# EAGLE design untitled (EAGLE 6.5.0)
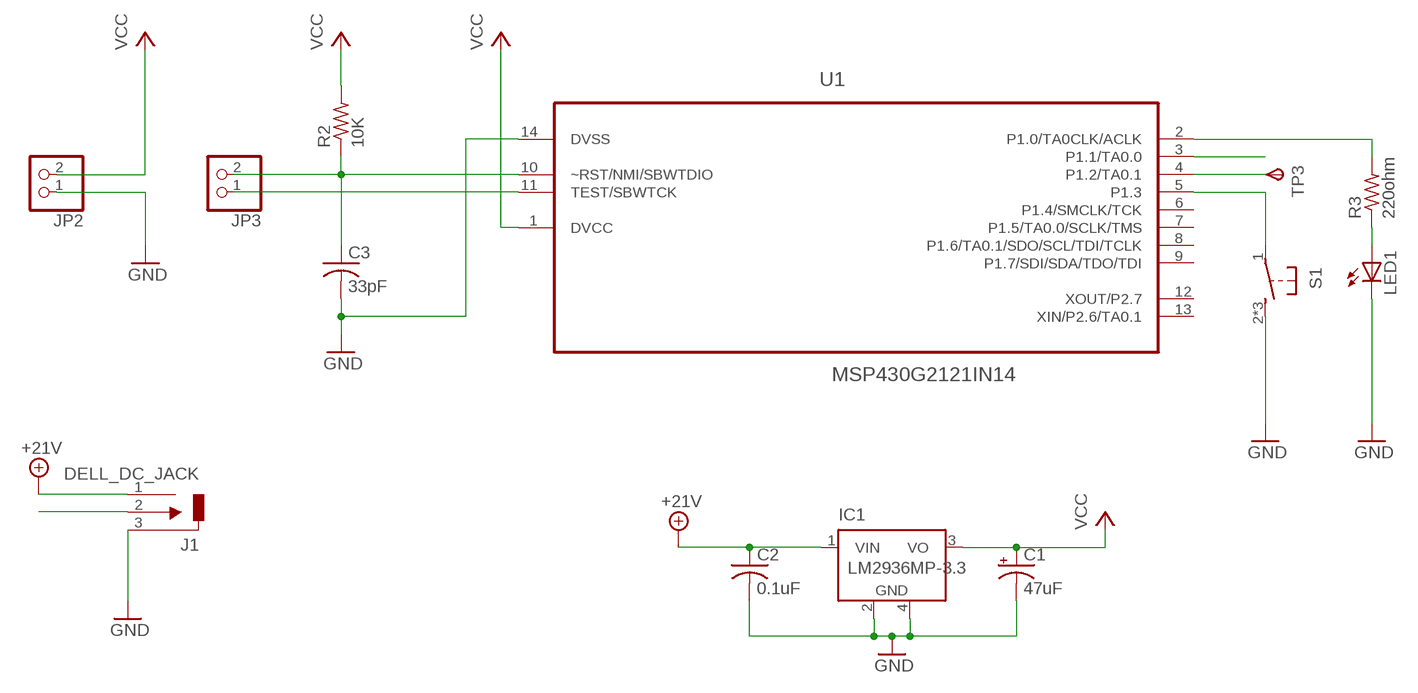
[diagram p0: schematic, sheet 1]

## Parts
C1  47uF  CPOL-USE2.5-5  [E2,5-5]
C2  0.1uF  C-US025-025X050  [C025-025X050]
C3  33pF  C-US025-025X050  [C025-025X050]
IC1  LM2936MP-3.3  [SOT223]
J1  DELL_DC_JACK  [DELL_DC_JACK]
JP2  PINHD-1X2  [1X02]
JP3  PINHD-1X2  [1X02]
LED1  LED3MM  [LED3MM]
R2  10K  R-US_0207/12  [0207/12]
R3  220ohm  R-US_0207/12  [0207/12]
S1  31-XX  [B3F-31XX]
TP3  TPSPAD1-13  [P1-13]
U1  MSP430G2121IN14  [DIP254P762X508-14]

## Nets
+21V: C2.1 IC1.1(VIN) J1.1(VIN)
GND: C1.- C2.2 C3.2 IC1.2(GND) IC1.4(GND) J1.3(GND) JP2.1 LED1.K(C) S1.2(S) S1.3(S) S1.4(S) U1.14(DVSS)
N$1: C3.1 JP3.2 R2.1 U1.10(~RST/NMI/SBWTDIO)
N$2: JP3.1 U1.11(TEST/SBWTCK)
N$3: R3.2 U1.2(P1.0/TA0CLK/ACLK)
N$4: LED1.A R3.1
N$5: TP3.TP(PP) U1.4(P1.2/TA0.1)
N$7: S1.1(P) U1.5(P1.3)
SIG: J1.2(SIG) U1.3(P1.1/TA0.0)
VCC: C1.+ IC1.3(VO) JP2.2 R2.2 U1.1(DVCC)
Unconnected: U1.6(P1.4/SMCLK/TCK) U1.7(P1.5/TA0.0/SCLK/TMS) U1.8(P1.6/TA0.1/SDO/SCL/TDI/TCLK) U1.9(P1.7/SDI/SDA/TDO/TDI) U1.12(XOUT/P2.7) U1.13(XIN/P2.6/TA0.1)

## Library data of the parts
C1 = rcl:CPOL-US: POLARIZED CAPACITOR, American symbol
C2 C3 = rcl:C-US: CAPACITOR, American symbol
IC1 = national-semiconductor:LM2936MP?*: Ultra-Low Quiescent Current LDO Voltage Regulator Source: Data sheet <http://www.national.com/ds/LM/LM2936.pdf>; MF: NATIONAL SEMICONDUCTOR; MPN: LM2936MP-3.3/NOPB; OC_FARNELL: 1469062; OC_NEWARK: 41K4523
J1 = custom:DELL_DC_JACK: DELL LAPTOP DC POWER JACK; OC_FARNELL: unknown; OC_NEWARK: unknown
JP2 JP3 = pinhead:PINHD-1X2: PIN HEADER
LED1 = led:LED: LED OSRAM: - CHIPLED LG R971, LG N971, LY N971, LG Q971, LY Q971, LO R971, LY R971 LH N974, LH R974 LS Q976, LO Q976, LY Q976 LO Q996 - Hyper CHIPLED LW Q18S LB Q993, LB Q99A, LB R99A - SideLED LS A670, LO A670, LY A670, LG A670, LP A670 LB A673, LV A673, LT A673, LW A673 LH A674 LY A675 LS A676, LA A676, LO A676, LY A676, LW A676 LS A679, LY A679, LG A679 - Hyper Micro SIDELED® LS Y876, LA Y876, LO Y876, LY Y876 LT Y87S - SmartLED LW L88C, LW L88S LB L89C, LB L89S, LG L890 LS L89K, LO L89K, LY L89K LS L896, LA L896, LO L896, LY L896 - TOPLED LS T670, LO T670, LY T670, LG T670, LP T670 LSG T670, LSP T670, LSY T670, LOP T670, LYG T670 LG T671, LOG T671, LSG T671 LB T673, LV T673, LT T673, LW T673 LH T674 LS T676, LA T676, LO T676, LY T676, LB T676, LH T676, LSB T676, LW T676 LB T67C, LV T67C, LT T67C, LS T67K, LO T67K, LY T67K, LW E67C LS E67B, LA E67B, LO E67B, LY E67B, LB E67C, LV E67C, LT E67C LW T67C LS T679, LY T679, LG T679 LS T770, LO T770, LY T770, LG T770, LP T770 LB T773, LV T773, LT T773, LW T773 LH T774 LS E675, LA E675, LY E675, LS T675 LS T776, LA T776, LO T776, LY T776, LB T776 LHGB T686 LT T68C, LB T68C - Hyper Mini TOPLED® LB M676 - Mini TOPLED Santana® LG M470 LS M47K, LO M47K, LY M47K Source: http://www.osram.convergy.de LUXEON: - LUMILED® LXK2-PW12-R00, LXK2-PW12-S00, LXK2-PW14-U00, LXK2-PW14-V00 LXK2-PM12-R00, LXK2-PM12-S00, LXK2-PM14-U00 LXK2-PE12-Q00, LXK2-PE12-R00, LXK2-PE12-S00, LXK2-PE14-T00, LXK2-PE14-U00 LXK2-PB12-K00, LXK2-PB12-L00, LXK2-PB12-M00, LXK2-PB14-N00, LXK2-PB14-P00, LXK2-PB14-Q00 LXK2-PR12-L00, LXK2-PR12-M00, LXK2-PR14-Q00, LXK2-PR14-R00 LXK2-PD12-Q00, LXK2-PD12-R00, LXK2-PD12-S00 LXK2-PH12-R00, LXK2-PH12-S00 LXK2-PL12-P00, LXK2-PL12-Q00, LXK2-PL12-R00 Source: www.luxeon.com KINGBRIGHT: KA-3528ASYC Source: www.kingbright.com
R2 R3 = resistor:R-US_: RESISTOR, American symbol
S1 = custom:31-XX: OMRON SWITCH; MPN: B3F-3100; OC_FARNELL: 959704; OC_NEWARK: 36M3582
TP3 = testpad:TPS: TEST PIN
U1 = Texas Instruments_By_element14_Batch_1:MSP430G2121IN14: MIXED SIGNAL MICROCONTROLLER; MPN: MSP430G2121IN14; OC_FARNELL: 1866841; OC_NEWARK: 72R5897; PACKAGE: PDIP-14; SUPPLIER: TEXAS INSTRUMENTS

## Board
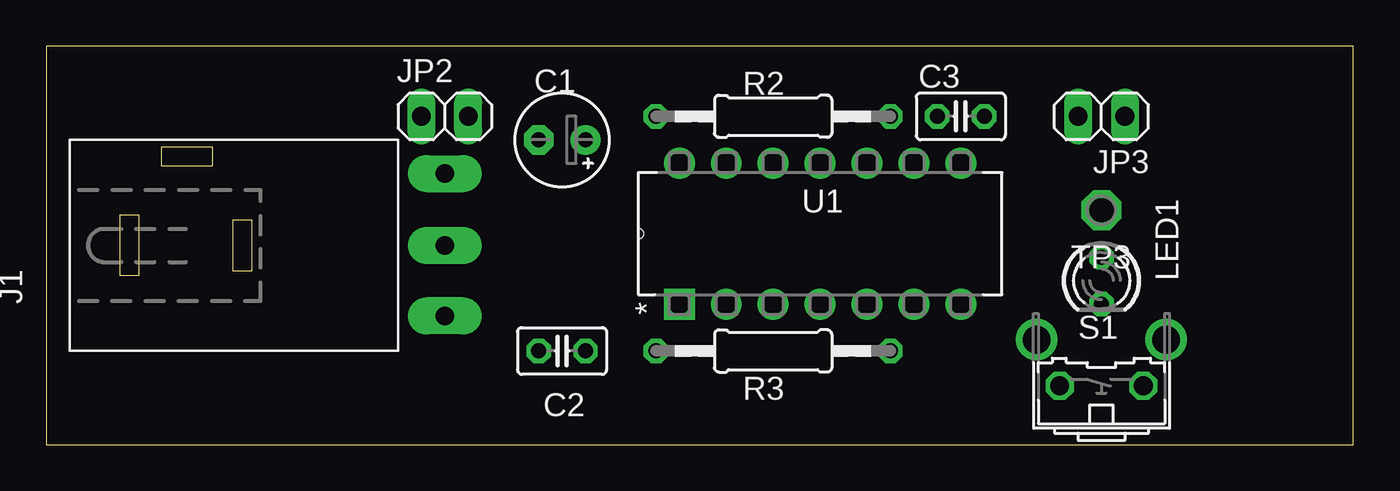
[diagram p1: board, top side]
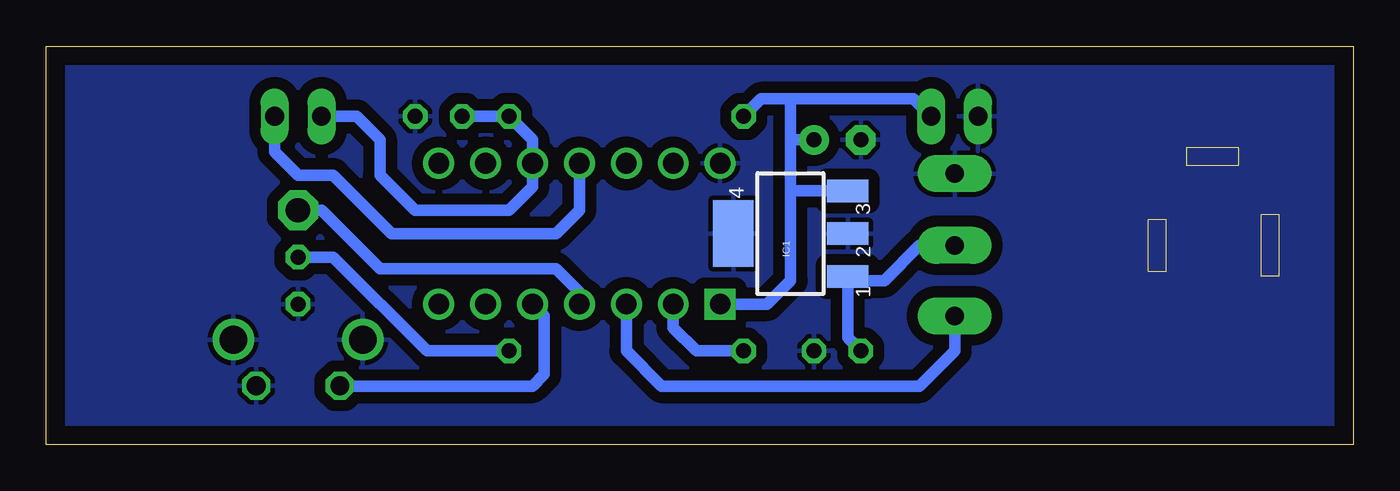
[diagram p2: board, bottom side, seen from below]

Size 70.79 x 21.58 mm. Coordinates in mm from the lower left corner, seen from the top.
Outline: 0,0 70.79,0 70.79,21.58 0,21.58 0,0
Copper layers (1*16): Top 0.035mm / dielectric 1.5mm / Bottom 0.035mm
Design rules "default": minimum track width 10mil, minimum drill 24mil, track to track 8mil, track to pad 8mil, pad to pad 8mil, via to via 8mil, smd to smd 8mil, copper to edge 40mil, drill to drill 8mil, minimum pad ring 10mil, minimum via ring 8mil, stop-mask expansion 4mil, vias tented up to drill 0mil, thermal gap 10mil

### Footprints (pad centres in the part's own frame; a part is rotated, then mirrored left to right if it is on the bottom)
E2,5-5 = drill 0.813 pad 1.6: + -1.27,0 | drill 0.813 pad 1.6 octagon: - 1.27,0
C025-025X050 = drill 0.813 octagon: 1 -1.27,0; 2 1.27,0
SOT223 = smd 1.219 x 2.235: 1 -2.311,-3.099; 2 0,-3.099; 3 2.311,-3.099 | smd 3.6 x 2.2: 4 0,3.099
DELL_DC_JACK = drill 1 pad 2 long: 1 0,-13.97; 2 -3.81,-13.97; 3 3.885,-13.97
1X02 = drill 1.016 long: 1 -1.27,0; 2 1.27,0
LED3MM = drill 0.813 octagon: A -1.27,0; K 1.27,0
0207/12 = drill 0.813 octagon: 1 -6.35,0; 2 6.35,0
B3F-31XX = drill 1.016 octagon: 1 -2.261,-1.245; 2 2.261,-1.245 | drill 1.499 pad 2.159: 3 -3.505,1.245; 4 3.505,1.245
P1-13 = drill 1.321 pad 2.159 octagon: TP 0,0
DIP254P762X508-14 = drill 1.118 square: 1 -7.62,15.24 | drill 1.118: 2 -7.62,12.7; 3 -7.62,10.16; 4 -7.62,7.62; 5 -7.62,5.08; 6 -7.62,2.54; 7 -7.62,0; 8 0,0; 9 0,2.54; 10 0,5.08; 11 0,7.62; 12 0,10.16; 13 0,12.7; 14 0,15.24

### Placement (x,y rotation side)
C1  27.94,16.51 180 top
C2  27.94,5.08 0 top
C3  49.53,17.78 0 top
IC1  30.48,11.43 90 bottom
J1  7.62,10.79 90 top
JP2  21.59,17.78 0 top
JP3  57.15,17.78 180 top
LED1  57.15,8.89 270 top
R2  39.37,17.78 180 top
R3  39.37,5.08 180 top
S1  57.15,4.45 0 top
TP3  57.15,12.7 90 top
U1  49.53,15.24 90 top

### Tracks (layer width: path | path; a pad name or v marks a point on that pad's centre or on a via)
+21V
  Bottom 0.61: IC1.1 27.15,8.89 25.4,8.89 23.5,10.79 J1.1 | 27.38,6.91 IC1.1 | C2.1 27.38,5.79 IC1.1
GND
  pour Bottom (isolate 0.61): 0,21.59 71.12,21.59 71.12,0 0,0
N$1
  Bottom 0.61: C3.1 R2.1 44.45,16.51 U1.10 44.45,13.97 45.72,12.7 50.8,12.7 52.7,14.61 52.7,16.51 53.98,17.78 JP3.2
N$2
  Bottom 0.61: U1.11 41.91,12.7 43.18,11.43 52.07,11.43 55.24,14.61 57.15,14.61 58.42,15.88 JP3.1
N$3
  Bottom 0.61: U1.2 36.83,6.35 35.56,5.08 R3.2
N$4
  Bottom 0.61: R3.1 50.16,5.08 55.24,10.16 LED1.A
N$5
  Bottom 0.61: U1.4 41.91,8.26 43.18,9.53 52.7,9.53 55.88,12.7 TP3.TP
N$7
  Bottom 0.61: U1.5 43.81,6.98 43.81,3.81 44.45,3.17 54.86,3.17 S1.1
SIG
  Bottom 0.61: U1.3 39.37,5.08 37.47,3.17 23.5,3.17 21.59,5.08 J1.2
VCC
  Bottom 0.61: U1.1 31.75,7.62 30.48,8.89 30.48,13.97 | JP2.2 23.81,18.73 30.48,18.73 | 30.48,18.73 32.07,18.73 R2.2 | 30.48,13.97 30.48,16.51 | 30.48,16.51 30.48,18.73 | IC1.3 30.25,13.74 arc90 30.48,13.97 | C1.+ 30.48,16.51